# EAGLE design timer555 (EAGLE 9.6.2)
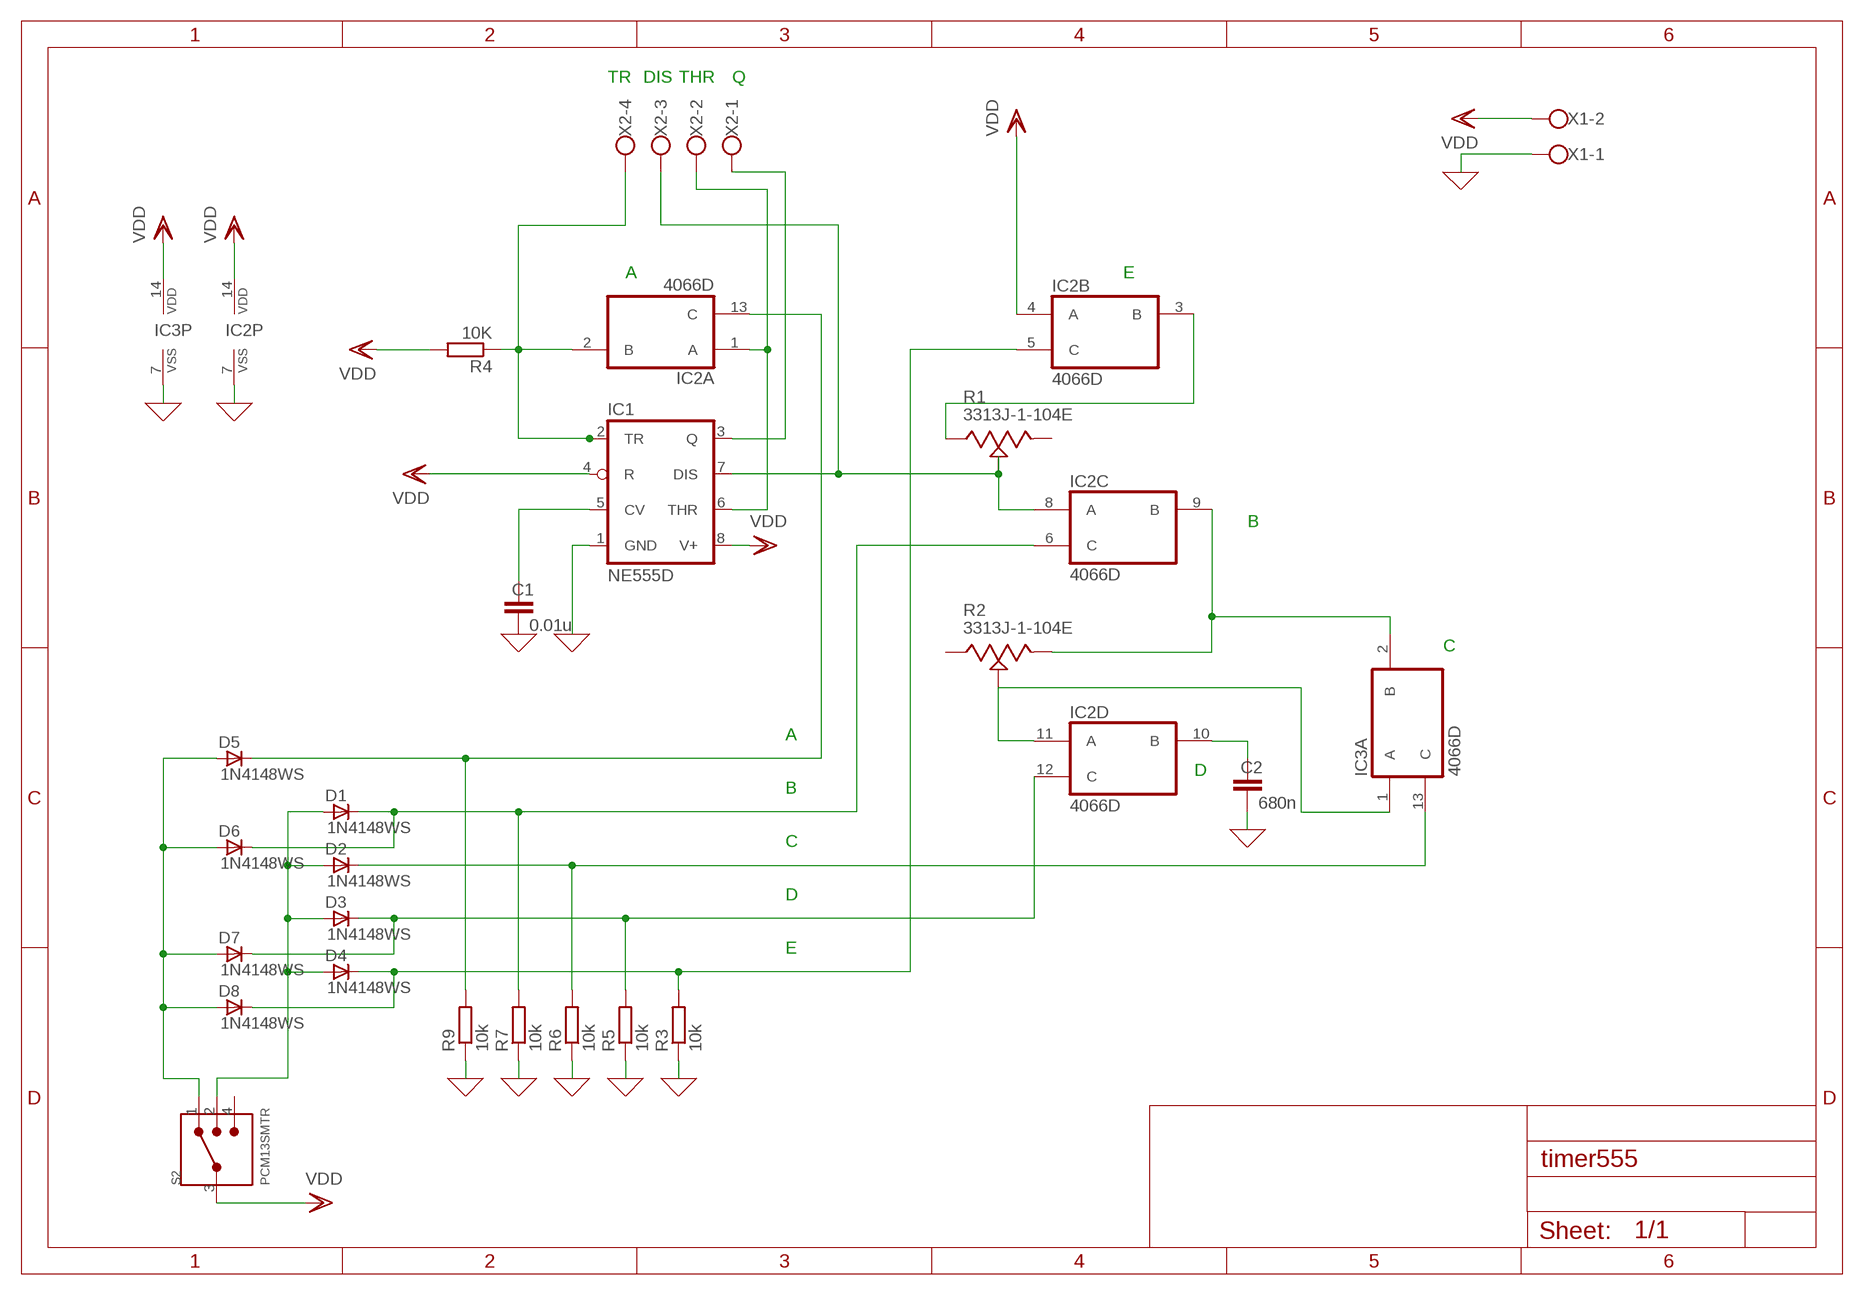
[diagram p0: schematic, sheet 1]

## Parts
C1  0.01u  C-EUC0805  [C0805]
C2  680n  C-EUC0805  [C0805]
D1  1N4148WS  [SOD323F]
D2  1N4148WS  [SOD323F]
D3  1N4148WS  [SOD323F]
D4  1N4148WS  [SOD323F]
D5  1N4148WS  [SOD323F]
D6  1N4148WS  [SOD323F]
D7  1N4148WS  [SOD323F]
D8  1N4148WS  [SOD323F]
IC1  NE555D  [SO08]
IC2  4066D  [SO14]
IC3  4066D  [SO14]
R1  3313J-1-104E  [TRIM_3313J-1-104E]
R2  3313J-1-104E  [TRIM_3313J-1-104E]
R3  10k  R-EU_R0805  [R0805]
R4  10K  R-EU_R0805  [R0805]
R5  10k  R-EU_R0805  [R0805]
R6  10k  R-EU_R0805  [R0805]
R7  10k  R-EU_R0805  [R0805]
R9  10k  R-EU_R0805  [R0805]
S2  PCM13SMTR  [SW_PCM13SMTR]
X1  W237-102  [W237-102]
X2  W237-4  [W237-4]

## Nets
0: C1.2 C2.2 IC1.1(GND) IC2.7(P:VSS) IC3.7(P:VSS) R3.1 R5.1 R6.1 R7.1 R9.1 X1.1 ; supply symbol labelled GND
N$1: C1.1 IC1.5(CV)
N$2: IC1.2(TR) IC2.2(A:B) R4.1 X2.4
N$3: D2.C IC3.13(A:C) R6.2
N$4: IC2.3(B:B) R1.1(CCW)
N$5: IC1.7(DIS) IC2.8(C:A) R1.2(WIPER) X2.3
N$6: IC2.9(C:B) IC3.2(A:B) R2.3(CW)
N$7: IC2.11(D:A) IC3.1(A:A) R2.2(WIPER)
N$8: C2.1 IC2.10(D:B)
N$9: D1.C D6.C IC2.6(C:C) R7.2
N$10: D5.C IC2.13(A:C) R9.2
N$11: IC1.3(Q) X2.1
N$13: D3.C D7.C IC2.12(D:C) R5.2
N$14: D4.C D8.C IC2.5(B:C) R3.2
N$15: D1.A D2.A D3.A D4.A S2.2
N$16: IC1.6(THR) IC2.1(A:A) X2.2
N$18: D5.A D6.A D7.A D8.A S2.1
VDD: IC1.4(R) IC1.8(V+) IC2.4(B:A) IC2.14(P:VDD) IC3.14(P:VDD) R4.2 S2.3 X1.2
Unconnected: IC3.3(B:B) IC3.4(B:A) IC3.5(B:C) IC3.6(C:C) IC3.8(C:A) IC3.9(C:B) IC3.10(D:B) IC3.11(D:A) IC3.12(D:C) R1.3(CW) R2.1(CCW) S2.4

## Notes on the sheet
- TR | DIS | THR | Q
- A | E
- B
- C
- A
- D
- B
- C
- D
- E

## Library data of the parts
C1 C2 = rcl:C-EU: CAPACITOR, European symbol; SPICEPREFIX: C
D1-D8 = _hhn_diodes_smd:1N4148WS: 1N4148 General Purpose Rectifie SMD-Version of 1N4148 Case: SOD 323 F Author: Dipl.-Ing. FH Rainer Bayer HHN Hochschule Heilbronn, rainer.bayer@hs-heilbronn.de Ingenieurbüro ing-rb, mail@ing-rb.de
IC1 = linear:*555: TIMER
IC2 IC3 = 40xx:4066: Quad bilateral ANALOG SWITCH
R1 R2 = 3313J-1-104E:3313J-1-104E: 200 kOhms 0.125W, 1/8W J Lead Surface Mount Trimmer Potentiometer Cermet 1 Turn Top Adjustment; DESCRIPTION: 100 kOhms 0.125W, 1/8W J Lead Surface Mount Trimmer Potentiometer Cermet 1 Turn Top Adjustment; DIGI-KEY_PART_NUMBER: 3313J-104ECT-ND; MF: Bourns; MP: 3313J-1-104E; PACKAGE: 5025 Bourns
R3-R7 R9 = rcl:R-EU_: RESISTOR, European symbol; SPICEPREFIX: R
S2 = PCM13SMTR:PCM13SMTR: PCM Series SP3T On-On-On Right Angle Gull Wing SMT Ultraminiature Slide Switch; AVAILABILITY: Unavailable; DESCRIPTION: Slide Switch SP3T Surface Mount, Right Angle; MF: C&K; MP: PCM13SMTR; PACKAGE: None; PRICE: None
X1 = con-wago-500:W237-102: WAGO SCREW CLAMP; MPN: 237-102; OC_FARNELL: unknown; OC_NEWARK: 70K9898
X2 = con-wago-500:W237-4: WAGO SCREW CLAMP; OC_FARNELL: unknown; OC_NEWARK: unknown

## Board
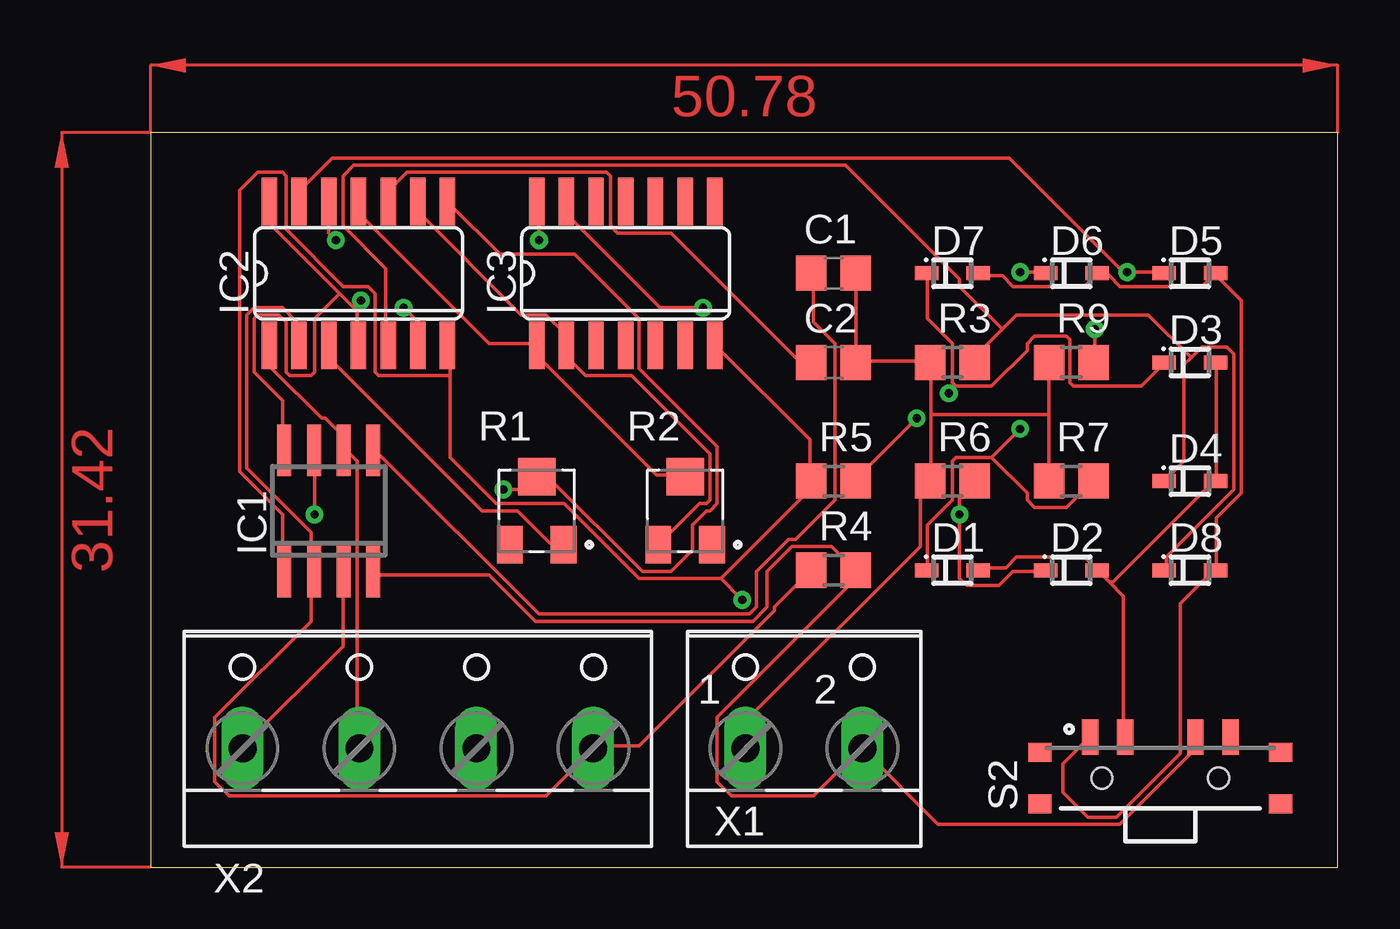
[diagram p1: board, top side]
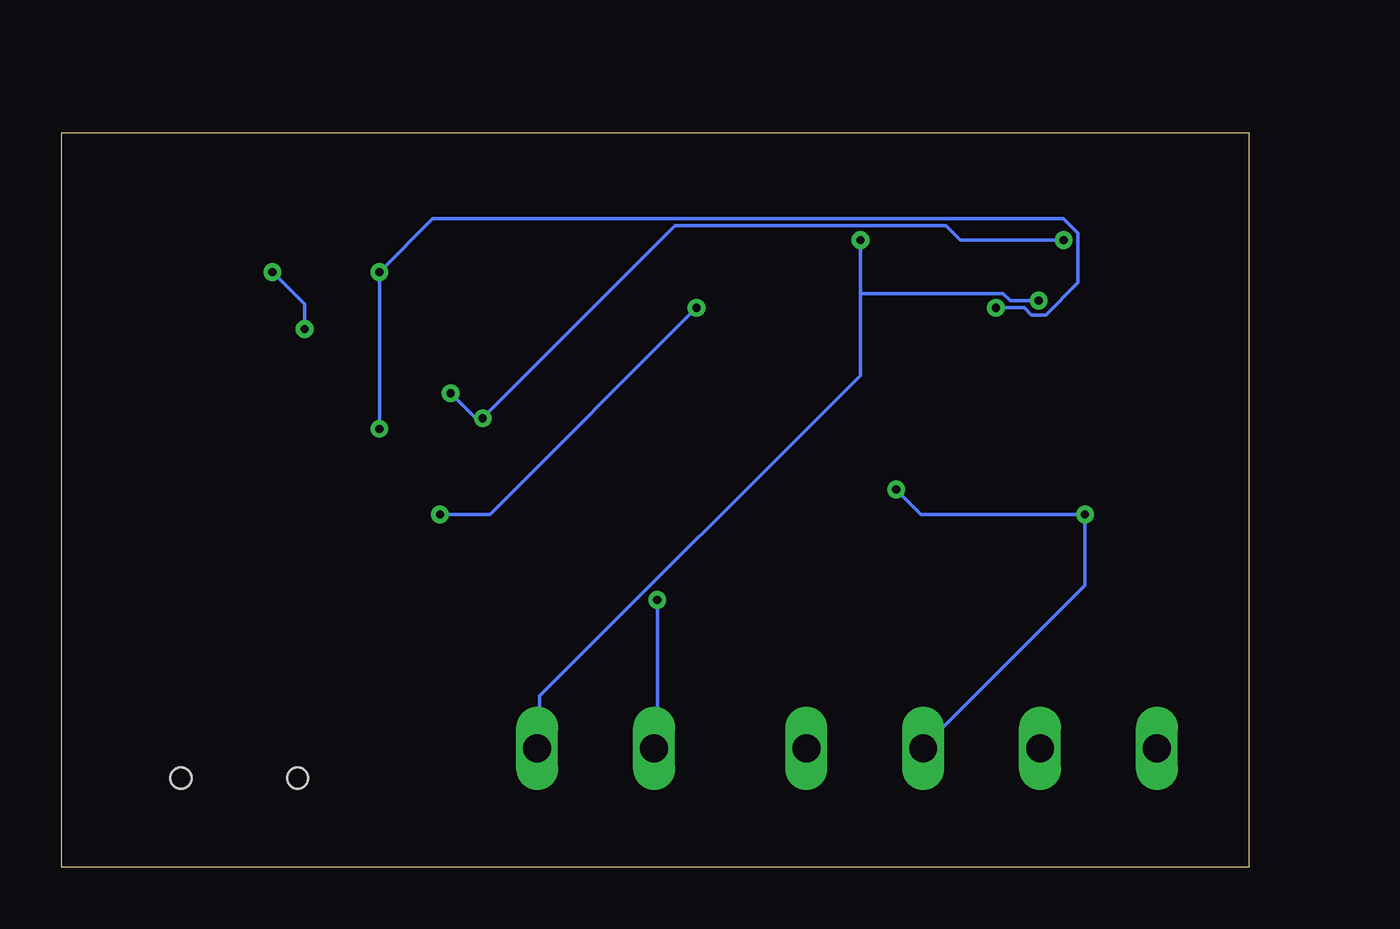
[diagram p2: board, bottom side, seen from below]

Size 50.78 x 31.42 mm. Coordinates in mm from the lower left corner, seen from the top.
Outline: 0,0 50.78,0 50.78,31.42 0,31.42 0,0
Copper layers (1*16): Top 0.035mm / dielectric 1.5mm / Bottom 0.035mm
Design rules "default": minimum track width 6mil, minimum drill 0.35mm, track to track 6mil, track to pad 6mil, pad to pad 6mil, via to via 6mil, smd to smd 6mil, copper to edge 40mil, drill to drill 6mil, minimum pad ring 10mil, minimum via ring 8mil, stop-mask expansion 4mil, vias tented up to drill 0mil, thermal gap 10mil

### Footprints (pad centres in the part's own frame; a part is rotated, then mirrored left to right if it is on the bottom)
C0805 = smd 1.3 x 1.5: 1 -0.95,0; 2 0.95,0
SOD323F = smd 1 x 0.6: A 1.1,0; C -1.1,0
SO08 = smd 0.6 x 2.2: 1 -1.905,-2.6; 2 -0.635,-2.6; 3 0.635,-2.6; 4 1.905,-2.6; 5 1.905,2.6; 6 0.635,2.6; 7 -0.635,2.6; 8 -1.905,2.6
SO14 = smd 0.66 x 2.032: 1 -3.81,-3.073; 2 -2.54,-3.073; 3 -1.27,-3.073; 4 0,-3.073; 5 1.27,-3.073; 6 2.54,-3.073; 7 3.81,-3.073; 8 3.81,3.073; 9 2.54,3.073; 10 1.27,3.073; 11 0,3.073; 12 -1.27,3.073; 13 -2.54,3.073; 14 -3.81,3.073
TRIM_3313J-1-104E = smd 1.1 x 1.6: 1 1.15,-1.45; 3 -1.15,-1.45 | smd 1.6 x 1.6: 2 0,1.45
R0805 = smd 1.3 x 1.5: 1 -0.95,0; 2 0.95,0
SW_PCM13SMTR = smd 0.7 x 1.5: 1 -3,1.75; 2 -1.5,1.75; 3 1.5,1.75; 4 3,1.75 | smd 1 x 0.8: P$1 -5.15,1.1; P$2 -5.15,-1.1; P$3 5.15,1.1; P$4 5.15,-1.1 | hole 0.9: -2.5,0; 2.5,0
W237-102 = drill 1.194 long: 1 -2.5,-1.27; 2 2.5,-1.27
W237-4 = drill 1.194 long: 1 -7.5,-1.27; 2 -2.5,-1.27; 3 2.5,-1.27; 4 7.5,-1.27

### Placement (x,y rotation side)
C1  29.21,25.4 0 top
C2  29.21,21.59 0 top
D1  34.29,12.7 0 top
D2  39.37,12.7 0 top
D3  44.45,21.59 0 top
D4  44.45,16.51 0 top
D5  44.45,25.4 0 top
D6  39.37,25.4 0 top
D7  34.29,25.4 0 top
D8  44.45,12.7 0 top
IC1  7.62,15.24 0 top
IC2  8.89,25.4 0 top
IC3  20.32,25.4 0 top
R1  16.51,15.24 0 top
R2  22.86,15.24 0 top
R3  34.29,21.59 0 top
R4  29.21,12.7 0 top
R5  29.21,16.51 0 top
R6  34.29,16.51 0 top
R7  39.37,16.51 0 top
R9  39.37,21.59 0 top
S2  43.18,3.81 0 top
X1  27.94,6.35 0 top
X2  11.43,6.35 0 top

### Tracks (layer width: path | path; a pad name or v marks a point on that pad's centre or on a via)
0  (via drill 0.35)
  Top 0.152: 38.41,19.36 38.41,21.49 R9.1 | 38.41,19.36 38.41,16.61 R7.1 | 33.38,19.36 33.38,21.49 R3.1 33.22,21.64 30.18,21.64 | 33.38,19.36 33.38,16.61 R6.1 33.22,16.46 32.92,16.15 32.92,13.72 25.45,6.25 25.45,5.18 X1.1 | 30.18,21.64 30.18,25.3 C1.2 | 30.18,21.64 C2.2 | 33.38,19.36 38.41,19.36 | IC3.7 24.23,22.25 28.19,18.29 28.19,16.61 R5.1 28.19,16.46 28.19,16.15 24.38,12.34 | 12.8,21.03 12.8,17.53 14.78,15.54 17.68,15.54 20.88,12.34 24.38,12.34 | 12.8,21.03 12.8,22.25 IC2.7 | 12.8,21.03 9.75,21.03 9.6,21.18 9.6,24.54 9.3,24.84 8.23,24.84 5.79,27.28 5.79,29.57 5.64,29.72 4.57,29.72 3.81,28.96 3.81,16.92 5.64,15.09 5.64,12.65 IC1.1 | 24.38,12.34 v25.3,11.43
  Bottom 0.152: v25.3,11.43 25.3,5.18 X1.1
N$1
  Top 0.152: C1.1 28.35,25.3 28.35,23.32 29.26,22.4 29.26,15.7 27.58,14.02 27.28,14.02 25.91,12.65 25.91,11.12 25.6,10.82 16.61,10.82 9.6,17.83 IC1.5
N$2
  Top 0.152: IC2.2 6.25,22.4 6.25,23.32 5.64,23.93 4.42,23.93 4.12,23.62 4.12,17.07 6.86,14.33 6.86,12.65 IC1.2 6.86,12.5 6.86,10.52 2.74,6.4 2.74,3.66 3.35,3.05 16.92,3.05 18.9,5.03 X2.4 19.05,5.18 20.88,5.18 26.67,10.97 26.67,11.12 28.19,12.65 R4.1
N$3  (via drill 0.35)
  Top 0.152: D2.C 38.25,12.65 36.88,12.65 36.27,12.04 34.9,12.04 34.59,12.34 v34.59,15.09 34.59,15.85 35.2,16.46 R6.2 | v23.62,23.93 21.79,23.93 17.83,27.89 17.83,28.35 IC3.13
  Bottom 0.152: v23.62,23.93 32.46,15.09 v34.59,15.09
N$4
  Top 0.152: IC2.3 7.62,21.79 14.17,15.24 15.7,15.24 17.07,13.87 17.53,13.87 R1.1
N$5  (via drill 0.35)
  Top 0.152: v7.01,15.09 7.01,17.83 IC1.7 | IC2.8 12.8,28.35 14.94,26.21 18.14,26.21 20.88,23.47 20.88,21.34 24.23,17.98 24.23,15.54 23.93,15.24 23.77,15.24 23.16,14.63 23.16,13.56 22.25,12.65 21.03,12.65 17.07,16.61 16.61,16.61 R1.2 16.46,16.61 16,16.15 v15.09,16.15
  Bottom 0.152: X2.3 13.87,5.18 7.01,12.04 v7.01,15.09 14.02,15.09 v15.09,16.15
N$6
  Top 0.152: R2.3 21.79,13.87 23.47,15.54 23.77,15.54 23.93,15.7 23.93,17.68 20.57,21.03 18.59,21.03 17.83,21.79 17.83,22.25 IC3.2 17.68,22.4 17.68,22.86 16.92,23.62 15.85,23.62 11.43,28.04 IC2.9
N$7
  Top 0.152: R2.2 22.86,16.76 21.64,16.76 16.61,21.79 16.61,22.25 IC3.1 16.46,22.4 14.48,22.4 8.99,27.89 8.99,28.35 IC2.11
N$8
  Top 0.152: C2.1 28.19,21.64 27.74,21.64 22.25,27.13 19.96,27.13 19.66,27.43 19.66,29.57 19.51,29.72 10.97,29.72 10.21,28.96 10.21,28.5 IC2.10
N$9  (via drill 0.35)
  Top 0.152: 35.97,17.53 34.44,17.53 34.29,17.37 34.29,15.7 33.22,14.63 33.22,12.8 D1.C | 35.97,17.53 37.49,16 37.49,15.7 37.8,15.39 39.17,15.39 40.23,16.46 R7.2 | v37.19,25.45 38.25,25.45 D6.C | 35.97,17.53 v37.19,18.75 | IC2.6 11.43,23.32 v10.82,23.93
  Bottom 0.152: v37.19,18.75 v37.19,25.45 34.9,27.74 7.92,27.74 7.32,27.13 7.32,24.99 8.69,23.62 9.3,23.62 9.6,23.93 v10.82,23.93
N$10  (via drill 0.35)
  Top 0.152: D5.C 43.28,25.45 v41.76,25.45 41.6,25.45 36.73,30.33 7.77,30.33 6.4,28.96 6.4,28.5 IC2.13 | v40.39,23.01 40.39,21.64 R9.2
  Bottom 0.152: v40.39,23.01 40.39,24.08 v41.76,25.45
N$11
  Top 0.152: IC1.3 8.23,12.5 8.23,9.45 3.96,5.18 X2.1
N$13  (via drill 0.35)
  Top 0.152: 34.44,20.57 34.29,20.73 34.29,22.4 33.22,23.47 33.22,25.3 D7.C | 34.44,20.57 35.97,20.57 37.49,22.1 37.49,22.4 37.8,22.71 39.17,22.71 39.32,22.55 39.32,20.73 39.47,20.57 42.37,20.57 43.28,21.49 D3.C | v32.77,19.2 30.18,16.61 R5.2 | 34.44,20.57 v34.14,20.27 | IC2.12 7.62,27.13 v7.92,26.82
  Bottom 0.152: v34.14,20.27 33.07,19.2 v32.77,19.2 24.54,27.43 12.95,27.43 12.34,26.82 v7.92,26.82
N$14
  Top 0.152: 44.5,21.79 44.2,21.49 44.2,17.37 43.43,16.61 D4.C | 44.5,21.79 44.96,22.25 46.02,22.25 46.33,21.95 46.33,16.15 43.43,13.26 43.43,12.8 D8.C | 36.42,23.01 37.03,23.62 42.67,23.62 44.5,21.79 | 36.42,23.01 35.36,21.95 35.36,21.64 R3.2 | 36.42,23.01 34.59,24.84 34.59,25.15 29.72,30.02 8.69,30.02 8.23,29.57 8.23,27.43 10.06,25.6 10.06,22.4 IC2.5
N$15
  Top 0.152: D3.A 45.57,21.49 45.57,16.61 D4.A 45.41,16.46 41.15,12.19 41,12.19 | D1.A 35.51,12.8 36.58,12.8 37.03,13.26 39.93,13.26 40.39,12.8 D2.A 40.54,12.65 41,12.19 | 41,12.19 41.6,11.58 41.6,5.64 S2.2
N$16
  Top 0.152: IC2.1 5.18,22.25 5.18,21.34 7.32,19.2 7.47,19.2 8.23,18.44 8.23,17.98 IC1.6 8.38,17.83 8.84,17.37 8.84,5.18 X2.2
N$18
  Top 0.152: D7.A 35.51,25.3 36.42,25.3 36.88,24.84 39.93,24.84 40.39,25.3 D6.A 40.54,25.3 41,25.3 41.45,24.84 44.96,24.84 45.41,25.3 D5.A 45.57,25.3 46.63,24.23 46.63,16 45.57,14.94 45.57,12.8 D8.A 45.41,12.65 44.04,11.28 44.04,4.88 41.3,2.13 40.08,2.13 39.01,3.2 39.01,4.42 40.08,5.49 S2.1
VDD  (via drill 0.35)
  Top 0.152: 8.08,24.54 5.18,27.43 5.18,28.35 IC2.14 | 8.08,24.54 8.69,23.93 | 8.69,23.93 8.84,23.77 8.84,22.4 IC2.4 | 8.08,24.54 7.01,23.47 7.01,21.18 6.86,21.03 5.94,21.03 5.79,21.18 5.79,23.32 5.49,23.62 4.57,23.62 4.42,23.47 4.42,21.18 5.64,19.96 5.64,17.98 IC1.8 | S2.3 44.65,5.49 44.65,5.03 41.45,1.83 33.68,1.83 30.48,5.03 X1.2 30.33,5.03 28.35,3.05 24.84,3.05 24.23,3.66 24.23,6.4 30.02,12.19 30.02,12.65 R4.2 30.02,12.8 29.11,13.72 27.43,13.72 26.36,12.65 26.36,11.12 25.76,10.52 16.46,10.52 14.48,12.5 9.6,12.5 IC1.4 | v16.61,26.82 16.61,28.35 IC3.14 | v8.99,24.23 8.69,23.93
  Bottom 0.152: 16.61,24.54 16.61,21.03 30.33,7.32 30.33,5.18 X1.2 | 16.61,24.54 v16.61,26.82 | v8.99,24.23 10.21,24.23 10.52,24.54 16.61,24.54
(copper drawn outside any net)
  shapes: Top area x2